# Altium project TCC-BoostEPonteH.PrjPcb
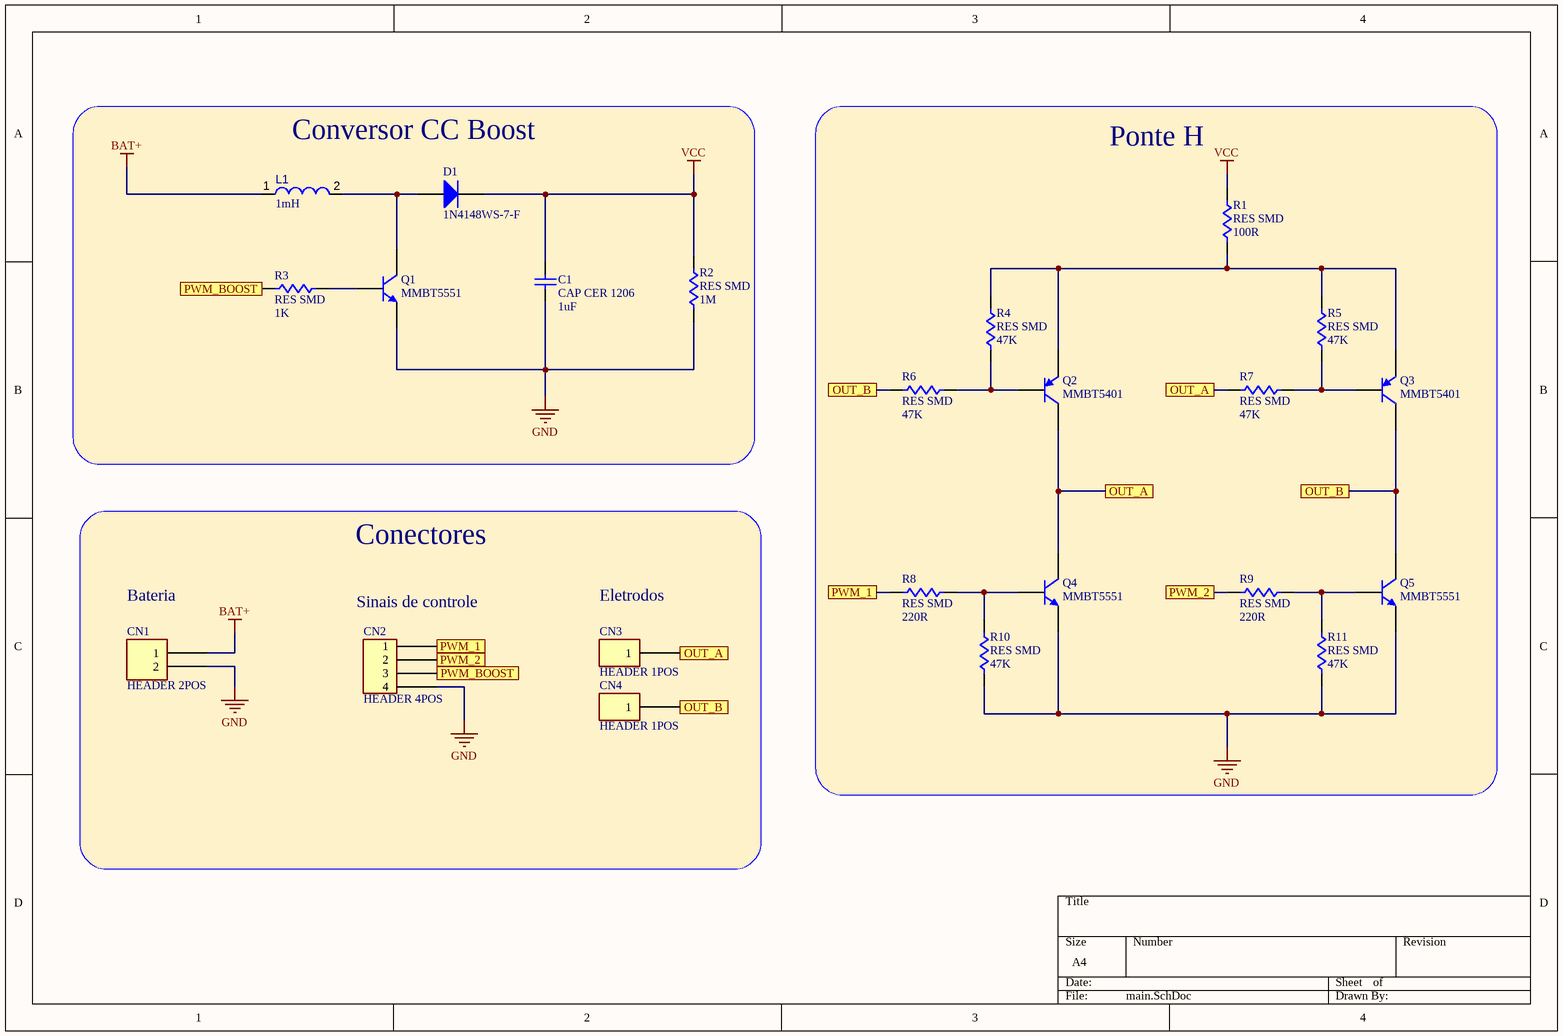
[diagram p0: main.SchDoc]
1 sheet, 23 parts. Net scope: flat (ports and power ports of the same name join across sheets).
Board file: pcb-main.PcbDoc

## Sheet main.SchDoc
size A4; SheetNumber: 1; SheetTotal: 1

### Parts
C1  CAP CER 1206  Valor: 1uF  [CAP CER 1206]
CN1  HEADER 2POS  [HEADER-MACHO-2POS]
CN2  HEADER 4POS  [HEADER-MACHO-4POS]
CN3  HEADER 1POS  [HEADER-MACHO-1POS]
CN4  HEADER 1POS  [HEADER-MACHO-1POS]
D1  1N4148WS-7-F  [DIOD-SOD323-2-A_V]
L1  value 1mH  [TDK-VLCF5028-2_V]  (hidden comment: VLCF5028T-2R7N1R8-2)
Q1  MMBT5551  [SOT-23 / Proto]
Q2  MMBT5401  [DIOD-SOT23-3_V]
Q3  MMBT5401  [DIOD-SOT23-3_V]
Q4  MMBT5551  [SOT-23 / Proto]
Q5  MMBT5551  [SOT-23 / Proto]
R1  RES SMD  Valor: 100R  [SMD 0603]
R2  RES SMD  Valor: 1M  [SMD 0603]
R3  RES SMD  Valor: 1K  [SMD 0603]
R4  RES SMD  Valor: 47K  [SMD 0603]
R5  RES SMD  Valor: 47K  [SMD 0603]
R6  RES SMD  Valor: 47K  [SMD 0603]
R7  RES SMD  Valor: 47K  [SMD 0603]
R8  RES SMD  Valor: 220R  [SMD 0603]
R9  RES SMD  Valor: 220R  [SMD 0603]
R10  RES SMD  Valor: 47K  [SMD 0603]
R11  RES SMD  Valor: 47K  [SMD 0603]

### Blocks framed on the sheet
Conversor CC Boost: C1 D1 L1 Q1 R2 R3
Ponte H: Q2-Q5 R1 R4-R11
Conectores: CN1-CN4

### Ports
OUT_A, OUT_B, PWM_1, PWM_2, PWM_BOOST

### Nets
BAT+: CN1.1 L1.1
GND: C1.1 CN1.2 CN2.4 Q1.2(E) Q4.2(E) Q5.2(E) R2.1 R10.1 R11.1
VCC: C1.2 D1.2(K) R1.2 R2.2
NetCN2_1: CN2.1 R8.1 ; port PWM_1
NetCN2_2: CN2.2 R9.1 ; port PWM_2
NetCN2_3: CN2.3 R3.1 ; port PWM_BOOST
NetCN3_1: CN3.1 Q2.3(C) Q4.3(C) R7.1 ; port OUT_A
NetCN4_1: CN4.1 Q3.3(C) Q5.3(C) R6.1 ; port OUT_B
NetD1_1: D1.1(A) L1.2 Q1.3(C)
NetQ1_1: Q1.1(B) R3.2
NetQ2_1: Q2.1(B) R4.1 R6.2
NetQ2_2: Q2.2(E) Q3.2(E) R1.1 R4.2 R5.2
NetQ3_1: Q3.1(B) R5.1 R7.2
NetQ4_1: Q4.1(B) R8.2 R10.2
NetQ5_1: Q5.1(B) R9.2 R11.2

### Notes on the sheet
- (near CN1) Bateria
- (near CN2) Sinais de controle
- (near CN3) Eletrodos

### Library data of the parts
C1 = CAP CER 1206: CAPACITOR DE CERAMICA 1206 SMD; ComponentLink1Description: New link; ComponentLink1URL: *; Item: CAP CER 1206; Part Number: *; Enderço Gaveteiro: *
CN1 = HEADER-MACHO-2POS: Conector barra de pinos Furo passante, 2 posições (2,54mm); Part Number: 61300211121; Endereço Gaveteiro: ***; Item: HEADER MACHO 2POS; ComponentLink1Description: HEADER MACHO 2POS; ComponentLink1URL: https://www.digikey.com/en/products/detail/w%C3%BCrth-elektronik/61300211121/4846823
CN2 = HEADER-MACHO-4POS: Conector barra de pinos Furo passante, 4 posições (2,54mm); Part Number: 61300411121; Endereço Gaveteiro: ***; Item: HEADER MACHO 4POS; ComponentLink1Description: HEADER MACHO 4POS; ComponentLink1URL: https://www.digikey.com/en/products/detail/w%C3%BCrth-elektronik/61300411121/4846827
CN3 CN4 = HEADER-MACHO-1POS: Conector barra de pinos Furo passante, 1 posições; Part Number: 61300211121; Endereço Gaveteiro: ***; Item: HEADER MACHO 2POS; ComponentLink1Description: HEADER MACHO 2POS; ComponentLink1URL: https://www.digikey.com/en/products/detail/w%C3%BCrth-elektronik/61300211121/4846823
D1 = CMP-004-00002-2: Fast Switching Diode, 75 V, 0.3 A, -65 to 150 degC, 2-Pin SOD323, RoHS, Tape and Reel; Manufacturer: Diodes Inc; Peak Reverse Current: 1uA; Max Surge Current: 2A; Elements: 1; Forward Current: 300mA; Recovery Time: 4ns; Forward Voltage: 1.25V; Datasheet Version: Rev. 25-2, 03/2016; Case/Package: SOD; Min Operating Temperature: -65°C; RoHS Compliant: True; Max Operating Temperature: 150°C; Manufacturer URL: http://www.diodes.com/; Pins: 2; Package Quantity: 3000; Datasheet URL: http://www.diodes.com/datasheets/ds30097.pdf; Packaging: TapeandReel; Package Description: 2-Pin Small Outline Diode, Body 1.7 x 1.3 mm; Mounting Technology: SM; Package Reference: SOD323-2
L1 = CMP-006-00017-6: Inductor for Power Circuits, 2.7 uH, +/- 30%,100 KHz, 1.82 A, -40 to 105 degC, 2-Pin SMD, RoHS, Reel; Manufacturer: TDK; Resistance: 0.033Ohm; Shielding: Shielded; Core Material: Ferrite; Current Rating: 1.82A; Tolerance: 30%; Package Quantity: 500; Datasheet Version: Apr-16; Max Operating Temperature: 105°C; RoHS Compliant: True; Min Operating Temperature: -40°C; Datasheet URL: https://product.tdk.com/info/en/catalog/datasheets/inductor_commercial_power_vlcf5028-2_en.pdf; Packaging: TapeandReel; Package Description: 2-Pin Surface Mount Device, Body 5.2 x 5.3 mm; Mounting Technology: SM; Saturation Current: 1.82A; Inductance Tolerance: 30%; Package Reference: VLCF5028-2; Case/Package: 5028
Q1 Q4 Q5 = BC847BLT1G: Transistor NPN 45V 0.1A; Part Number: BC847; Endereço Gaveteiro: ***; Item: Transistor NPN 45V 0.1A BC847; ComponentLink1Description: BC847; ComponentLink1URL: digikey.com/en/products/detail/onsemi/BC847BLT1G/918344
Q2 Q3 = CMP-00002-1: Small Signal Bipolar Transistor, 0.5A I(C), 300V V(BR)CEO, 1-Element, PNP, Silicon; Max Collector Current: 500mA; Package Body Material: Plastic; Frequency: 50MHz; Qualification Status: Not Qualified; Additional Feature: HIGH RELIABILITY; DC Current Gain-Min (hFE): 25; Power Dissipation-Max (Abs): 300mW; Transistor Application: SWITCHING; Number of Elements: 1; Time @ Peak Reflow Temperature-Max (s): 40s; Moisture Sensitivity Level: 1; JESD-609 Code: e3; Terminal Form: Gull Wing; Package Shape: Rectangular; JESD-30 Code: R-PDSO-G3; Terminal Finish: Tin; Package Style: SMALL OUTLINEMeter; Reach SVHC Compliant: Yes; Peak Reflow Temperature (Cel): 260°C; Collector-emitter Voltage-Max: 300V; Surface Mount: Yes; Polarity/Channel Type: PNP; Terminal Position: DUAL; Pins: 3; Transistor Element Material: SILICON; RoHS Compliant: Yes; Max Operating Temperature: 150°C
R1-R11 = RES SMD: Part number: *; Endereço gaveteiro: *; Item: RES SMD; ComponentLink1Description: Link; ComponentLink1URL: *